# EAGLE schematic fader (EAGLE 4.13)
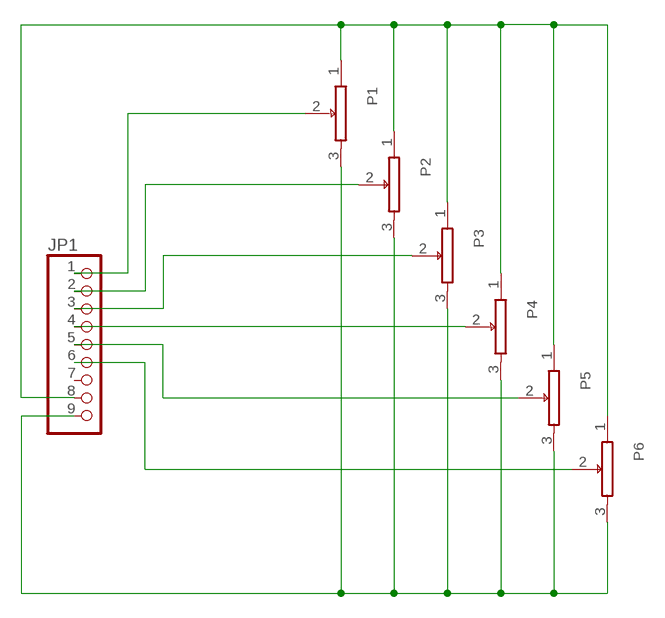
[diagram p0: schematic, sheet 1]

## Parts
JP1  PINHD-1X9  [1X09]
P1  POTL_1  [POTL_1]
P2  POTL_1  [POTL_1]
P3  POTL_1  [POTL_1]
P4  POTL_1  [POTL_1]
P5  POTL_1  [POTL_1]
P6  POTL_1  [POTL_1]

## Nets
GND: JP1.8 P1.1 P2.1 P3.1 P4.1 P5.1 P6.1
N$1: JP1.1 P1.2
N$2: JP1.2 P2.2
N$3: JP1.3 P3.2
N$4: JP1.4 P4.2
N$5: JP1.5 P5.2
N$6: JP1.6 P6.2
VCC: JP1.9 P1.3 P2.3 P3.3 P4.3 P5.3 P6.3
Unconnected: JP1.7

## Library data of the parts
JP1 = pinhead:PINHD-1X9: PIN HEADER
P1-P6 = Pot2:POTL_1